# EAGLE schematic stm_ethernet_poe (EAGLE 9.6.2)
REVISION: 1.0; TEAM: RoboRacing
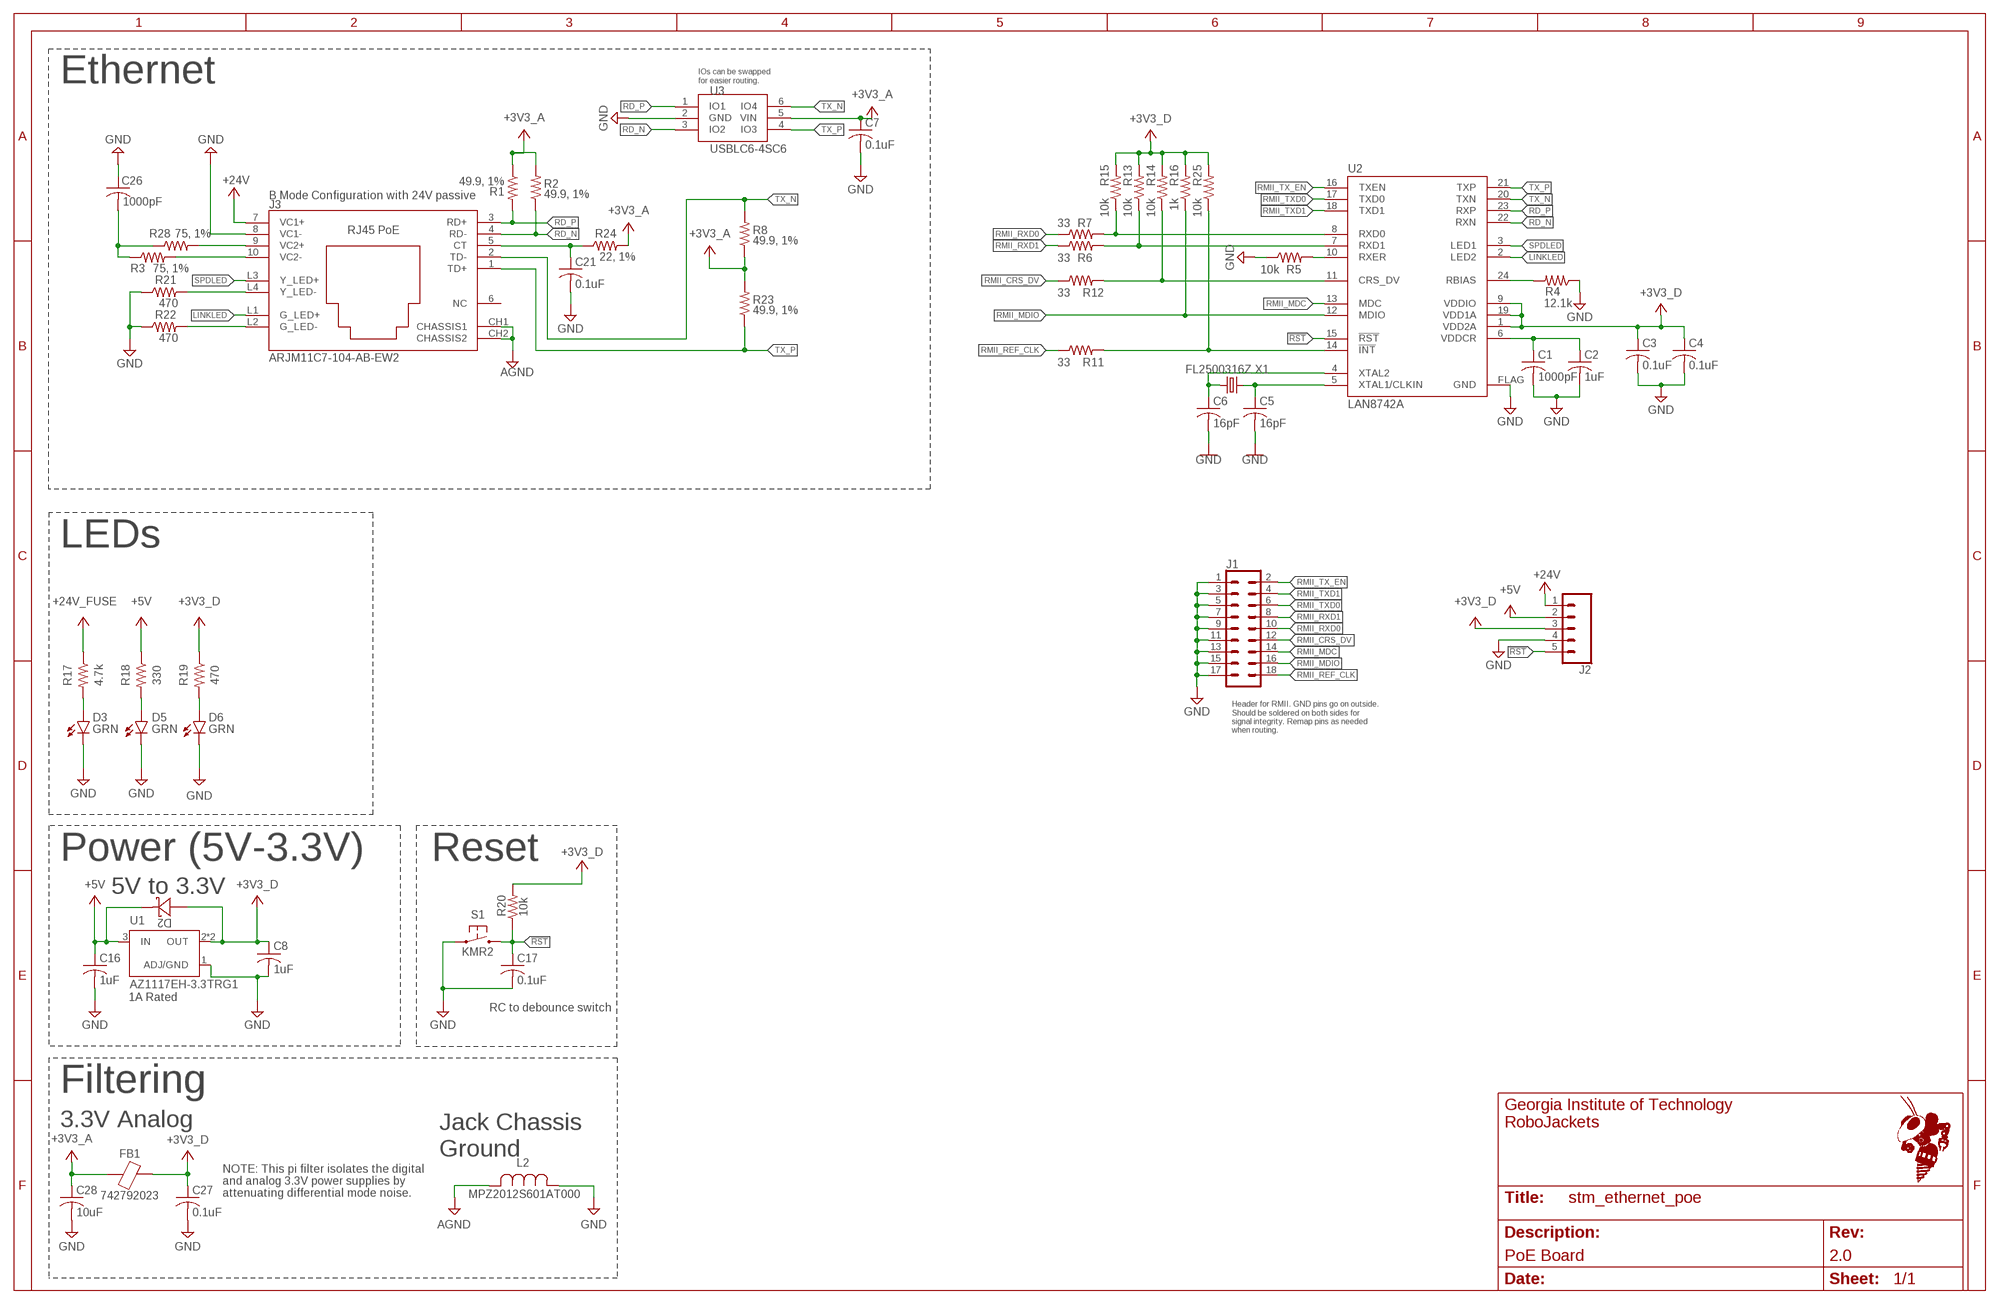
[diagram p0: schematic, sheet 1]
FRAME1 (FRAME_11_17): REVISION: 2.0; SCH_DESC: PoE Board; TEAM: RoboRacing

## Parts
C1  1000pF  C-USC0603  [C0603]
C2  1uF  C-USC0603  [C0603]
C3  0.1uF  C-USC0603  [C0603]
C4  0.1uF  C-USC0603  [C0603]
C5  16pF  C-USC0603  [C0603]
C6  16pF  C-USC0603  [C0603]
C7  0.1uF  C-USC0402  [C0402]
C8  1uF  C-USC0603  [C0603]
C16  1uF  C-USC0603  [C0603]
C17  0.1uF  C-USC0402  [C0402]
C21  0.1uF  C-USC0402  [C0402]
C26  1000pF  C-USC0603  [C0603]
C27  0.1uF  C-USC0603  [C0603]
C28  10uF  C-USC0603  [C0603]
D2  NTS260ESFT3G  [SOD123FL_DIO]
D3  GRN  LEDCHIP-LED0603  [CHIP-LED0603]
D5  GRN  LEDCHIP-LED0603  [CHIP-LED0603]
D6  GRN  LEDCHIP-LED0603  [CHIP-LED0603]
FB1  742792023  [0805]
J1  CONN_9X2  [2X9]
J2  CONN_05  [1X05]
J3  ARJM11C7-104-AB-EW2  [CONN_EW_ABR]
L2  MPZ2012S601AT000  [IND_2012_TDK]
R1  49.9, 1%  R-US_R0402  [R0402]
R2  49.9, 1%  R-US_R0402  [R0402]
R3  75, 1%  R-US_R0603  [R0603]
R4  12.1k  R-US_R0402  [R0402]
R5  10k  R-US_R0402  [R0402]
R6  33  R-US_R0402  [R0402]
R7  33  R-US_R0402  [R0402]
R8  49.9, 1%  R-US_R0402  [R0402]
R11  33  R-US_R0402  [R0402]
R12  33  R-US_R0402  [R0402]
R13  10k  R-US_R0402  [R0402]
R14  10k  R-US_R0402  [R0402]
R15  10k  R-US_R0402  [R0402]
R16  1k  R-US_R0402  [R0402]
R17  4.7k  R-US_R0603  [R0603]
R18  330  R-US_R0603  [R0603]
R19  470  R-US_R0603  [R0603]
R20  10k  R-US_R0603  [R0603]
R21  470  R-US_R0603  [R0603]
R22  470  R-US_R0603  [R0603]
R23  49.9, 1%  R-US_R0402  [R0402]
R24  22, 1%  R-US_R0603  [R0603]
R25  10k  R-US_R0402  [R0402]
R28  75, 1%  R-US_R0603  [R0603]
S1  KMR2  [KMR2]
U1  AZ1117EH-3.3TRG1  [SOT230P700X180-4N]
U2  LAN8742A  [VQFN24]
U3  USBLC6-4SC6  [6-SOT23-USBLC6]
X1  FL2500316Z  XTAL-3.2X2.5  [XTAL-3.2X2.5]

## Nets
3V3_LED: D6.A R19.2
5V_LED: D5.A R18.2
24V_LED: D3.A R17.2
!RST: C17.1 J2.5 R20.1 S1.2.1 S1.2.2 U2.15(!RST)
+3V3_A: C7.1 C28.1 FB1.1 R1.1 R2.2 R8.1 R23.2 R24.2 U3.5(VIN)
+3V3_D [power]: C3.1 C4.1 C8.1 C27.1 D2.2 FB1.2 J2.3 R13.2 R14.2 R15.2 R16.2 R19.1 R20.2 R25.2 U1.2(OUT) U1.4(OUT) U2.1(VDD2A) U2.9(VDDIO) U2.19(VDD1A)
+5V [power]: C16.1 D2.1 J2.2 R18.1 U1.3(IN)
+24V [power]: J2.1 J3.7(VC1+)
+24V_FUSE: R17.1
AGND: J3.CH1(CHASSIS1) J3.CH2(CHASSIS2) L2.2
CT: C21.1 J3.5(CT) R24.1
G_LED+: J3.L2(G_LED-) R22.2
GND [ethernet]: C1.2 C2.2 C3.2 C4.2 C5.2 C6.2 C7.2 C8.2 C16.2 C17.2 C21.2 C26.1 C27.2 C28.2 D3.C D5.C D6.C J1.1 J1.3 J1.5 J1.7 J1.9 J1.11 J1.13 J1.15 J1.17 J2.4 J3.8(VC1-) L2.1 R4.1 R5.1 R21.1 R22.1 S1.1.1 S1.1.2 U1.1(ADJ/GND) U2.FLAG(GND) U3.2(GND)
LINKLED: J3.L1(G_LED+) U2.2(LED2)
N$1: R4.2 U2.24(RBIAS)
N$2: C1.1 C2.1 U2.6(VDDCR)
N$4: R5.2 U2.10(RXER)
N$8: J3.9(VC2+) R28.2
N$9: R6.2 R13.1 U2.7(RXD1)
N$10: J3.10(VC2-) R3.2
N$11: R7.2 R15.1 U2.8(RXD0)
N$12: C26.2 R3.1 R28.1
N$14: R12.2 R14.1 U2.11(CRS_DV)
N$15: R11.2 R25.1 U2.14(!INT)
RD_N: J3.4(RD-) R2.1 U2.22(RXN) U3.3(IO2)
RD_P: J3.3(RD+) R1.2 U2.23(RXP) U3.1(IO1)
RMII_CRS_DV [ethernet]: J1.12 R12.1
RMII_MDC: J1.14 U2.13(MDC)
RMII_MDIO: J1.16 R16.1 U2.12(MDIO)
RMII_REF_CLK [ethernet]: J1.18 R11.1
RMII_RXD0 [ethernet]: J1.10 R7.1
RMII_RXD1: J1.8 R6.1
RMII_TX_EN: J1.2 U2.16(TXEN)
RMII_TXD0: J1.6 U2.17(TXD0)
RMII_TXD1: J1.4 U2.18(TXD1)
SPDLED: J3.L3(Y_LED+) U2.3(LED1)
TX_N [ethernet]: J3.2(TD-) R8.2 U2.20(TXN) U3.6(IO4)
TX_P [ethernet]: J3.1(TD+) R23.1 U2.21(TXP) U3.4(IO3)
XTAL1: C6.1 U2.4(XTAL2) X1.1
XTAL2: C5.1 U2.5(XTAL1/CLKIN) X1.3
Y_LED+: J3.L4(Y_LED-) R21.2
Unconnected: J3.6(NC)

## Notes on the sheet
- Ethernet
- IOs can be swapped
  for easier routing.
- B Mode Configuration with 24V passive
- LEDs
- Header for RMII. GND pins go on outside.
  Should be soldered on both sides for
  signal integrity. Remap pins as needed
  when routing.
- Power (5V-3.3V) | Reset
- 5V to 3.3V
- 1A Rated
- RC to debounce switch
- Filtering
- 3.3V Analog
- Jack Chassis
  Ground
- NOTE: This pi filter isolates the digital 
  and analog 3.3V power supplies by
  attenuating differential mode noise.

## Library data of the parts
C1-C4 C7 C17 C21 C27 C28 = adafruit:C-US: CAPACITOR, American symbol
C5 C6 = resistor:C-US: CAPACITOR, American symbol
C8 C16 C26 = rcl:C-US: CAPACITOR, American symbol; SPICEPREFIX: C
D2 = ethernet_poe:NTS260ESFT3G: Diode Schottky 2A Surface Mount SOD-123FL; DKPN: NTS260ESFT3GOSCT-ND
D3 D5 D6 = led:LED: LED OSRAM: - CHIPLED LG R971, LG N971, LY N971, LG Q971, LY Q971, LO R971, LY R971 LH N974, LH R974 LS Q976, LO Q976, LY Q976 LO Q996 - Hyper CHIPLED LW Q18S LB Q993, LB Q99A, LB R99A - SideLED LS A670, LO A670, LY A670, LG A670, LP A670 LB A673, LV A673, LT A673, LW A673 LH A674 LY A675 LS A676, LA A676, LO A676, LY A676, LW A676 LS A679, LY A679, LG A679 - Hyper Micro SIDELED® LS Y876, LA Y876, LO Y876, LY Y876 LT Y87S - SmartLED LW L88C, LW L88S LB L89C, LB L89S, LG L890 LS L89K, LO L89K, LY L89K LS L896, LA L896, LO L896, LY L896 - TOPLED LS T670, LO T670, LY T670, LG T670, LP T670 LSG T670, LSP T670, LSY T670, LOP T670, LYG T670 LG T671, LOG T671, LSG T671 LB T673, LV T673, LT T673, LW T673 LH T674 LS T676, LA T676, LO T676, LY T676, LB T676, LH T676, LSB T676, LW T676 LB T67C, LV T67C, LT T67C, LS T67K, LO T67K, LY T67K, LW E67C LS E67B, LA E67B, LO E67B, LY E67B, LB E67C, LV E67C, LT E67C LW T67C LS T679, LY T679, LG T679 LS T770, LO T770, LY T770, LG T770, LP T770 LB T773, LV T773, LT T773, LW T773 LH T774 LS E675, LA E675, LY E675, LS T675 LS T776, LA T776, LO T776, LY T776, LB T776 LHGB T686 LT T68C, LB T68C - Hyper Mini TOPLED® LB M676 - Mini TOPLED Santana® LG M470 LS M47K, LO M47K, LY M47K Source: http://www.osram.convergy.de LUXEON: - LUMILED® LXK2-PW12-R00, LXK2-PW12-S00, LXK2-PW14-U00, LXK2-PW14-V00 LXK2-PM12-R00, LXK2-PM12-S00, LXK2-PM14-U00 LXK2-PE12-Q00, LXK2-PE12-R00, LXK2-PE12-S00, LXK2-PE14-T00, LXK2-PE14-U00 LXK2-PB12-K00, LXK2-PB12-L00, LXK2-PB12-M00, LXK2-PB14-N00, LXK2-PB14-P00, LXK2-PB14-Q00 LXK2-PR12-L00, LXK2-PR12-M00, LXK2-PR14-Q00, LXK2-PR14-R00 LXK2-PD12-Q00, LXK2-PD12-R00, LXK2-PD12-S00 LXK2-PH12-R00, LXK2-PH12-S00 LXK2-PL12-P00, LXK2-PL12-Q00, LXK2-PL12-R00 Source: www.luxeon.com KINGBRIGHT: KA-3528ASYC Source: www.kingbright.com
FB1 = ethernet_poe:742792023: 120 Ohms @ 100MHz 1 Signal Line Ferrite Bead 0805 (2012 Metric) 3A 30mOhm; DKPN: 732-1613-1-ND
J1 = ethernet_poe_stm_v1.0:CONN_9X2: Multi connection point. Often used as Generic Header-pin footprint for 0.1 inch spaced/style header connections
J2 = SparkFun-Connectors:CONN_05: Multi connection point. Often used as Generic Header-pin footprint for 0.1 inch spaced/style header connections On any of the 0.1 inch spaced packages, you can populate with these: Break Away Headers - Straight <https://www.sparkfun.com/products/116> (PRT-00116) Break Away Male Headers - Right Angle <https://www.sparkfun.com/products/553> (PRT-00553) Female Headers <https://www.sparkfun.com/products/115> (PRT-00115) Break Away Headers - Machine Pin <https://www.sparkfun.com/products/117> (PRT-00117) Break Away Female Headers - Swiss Machine Pin <https://www.sparkfun.com/products/743> (PRT-00743) For SCREWTERMINALS and SPRING TERMINALS visit here: Screw Terimnals on SparkFun.com <https://www.sparkfun.com/search/results?term=Screw+Terminals> (5mm/3.5mm/2.54mm spacing) This device is also useful as a general connection point to wire up your design to another part of your project. Our various solder wires solder well into these plated through hole pads. Hook-Up Wire - Assortment (Stranded, 22 AWG) <https://www.sparkfun.com/products/11375> (PRT-11375) Hook-Up Wire - Assortment (Solid Core, 22 AWG) <https://www.sparkfun.com/products/11367> (PRT-11367) View the entire wire category on our website here <https://www.sparkfun.com/categories/141> Special notes: Molex polarized connector foot print use with SKU : PRT-08231 with associated crimp pins and housings. 1MM SMD Version SKU: PRT-10208
J3 = ethernet_poe:ARJM11C7-104-AB-EW2: 1 Port RJ45 Magjack Connector Through Hole 10/100 Base-T, AutoMDIX, Power over Ethernet (PoE); DKPN: 535-14148-ND
L2 = POE:MPZ2012S601AT000; BUILT_BY: EMA_UL_Team; MANUFACTURER_PART_NUMBER: MPZ2012S601AT000; SOURCELIBRARY: TDK_2015_05_22; VENDOR: TDK
R1 R2 R4-R8 R11-R16 R23 R25 = adafruit:R-US_: RESISTOR, American symbol
R3 R17-R22 R24 R28 = rcl:R-US_: RESISTOR, American symbol; SPICEPREFIX: R
S1 = RoboJackets-Switches:KMR2; FUNCTION: Reset
U1 = ethernet_poe:AZ1117EH-3.3TRG1: LDO Voltage Regulator 3.3V, 1A, Sot223; DKPN: AZ1117EH-3.3TRG1DICT-ND
U2 = RoboRacing_STM:LAN8742A: Datasheet Link: https://ww1.microchip.com/downloads/en/DeviceDoc/DS_LAN8742_00001989A.pdf; DKPN: LAN8742A-CZ-TR-ND
U3 = ethernet_poe_stm_v1.0:USBLC6-4SC6: EDS suppression chip: https://www.st.com/content/ccc/resource/technical/document/datasheet/9a/e6/1c/4f/b6/9a/44/e6/CD00047494.pdf/files/CD00047494.pdf/jcr:content/translations/en.CD00047494.pdf
X1 = RoboJackets-FreqGen:XTAL

## Net classes
0 default: width 0.203 mm, drill 0.508 mm, clearance 0.203 mm
1 power: width 0.254 mm, drill 0.508 mm, clearance 0.203 mm to class 0, clearance 0.203 mm
2 ethernet: width 0.203 mm, drill 0.406 mm, clearance 0.203 mm to class 0, clearance 0.203 mm to class 1, clearance 0.203 mm